# EAGLE design qo-100-env-sensors (EAGLE 9.6.1)
CNAME: None; CREVISION: 1; DESIGNER: Joao Silva
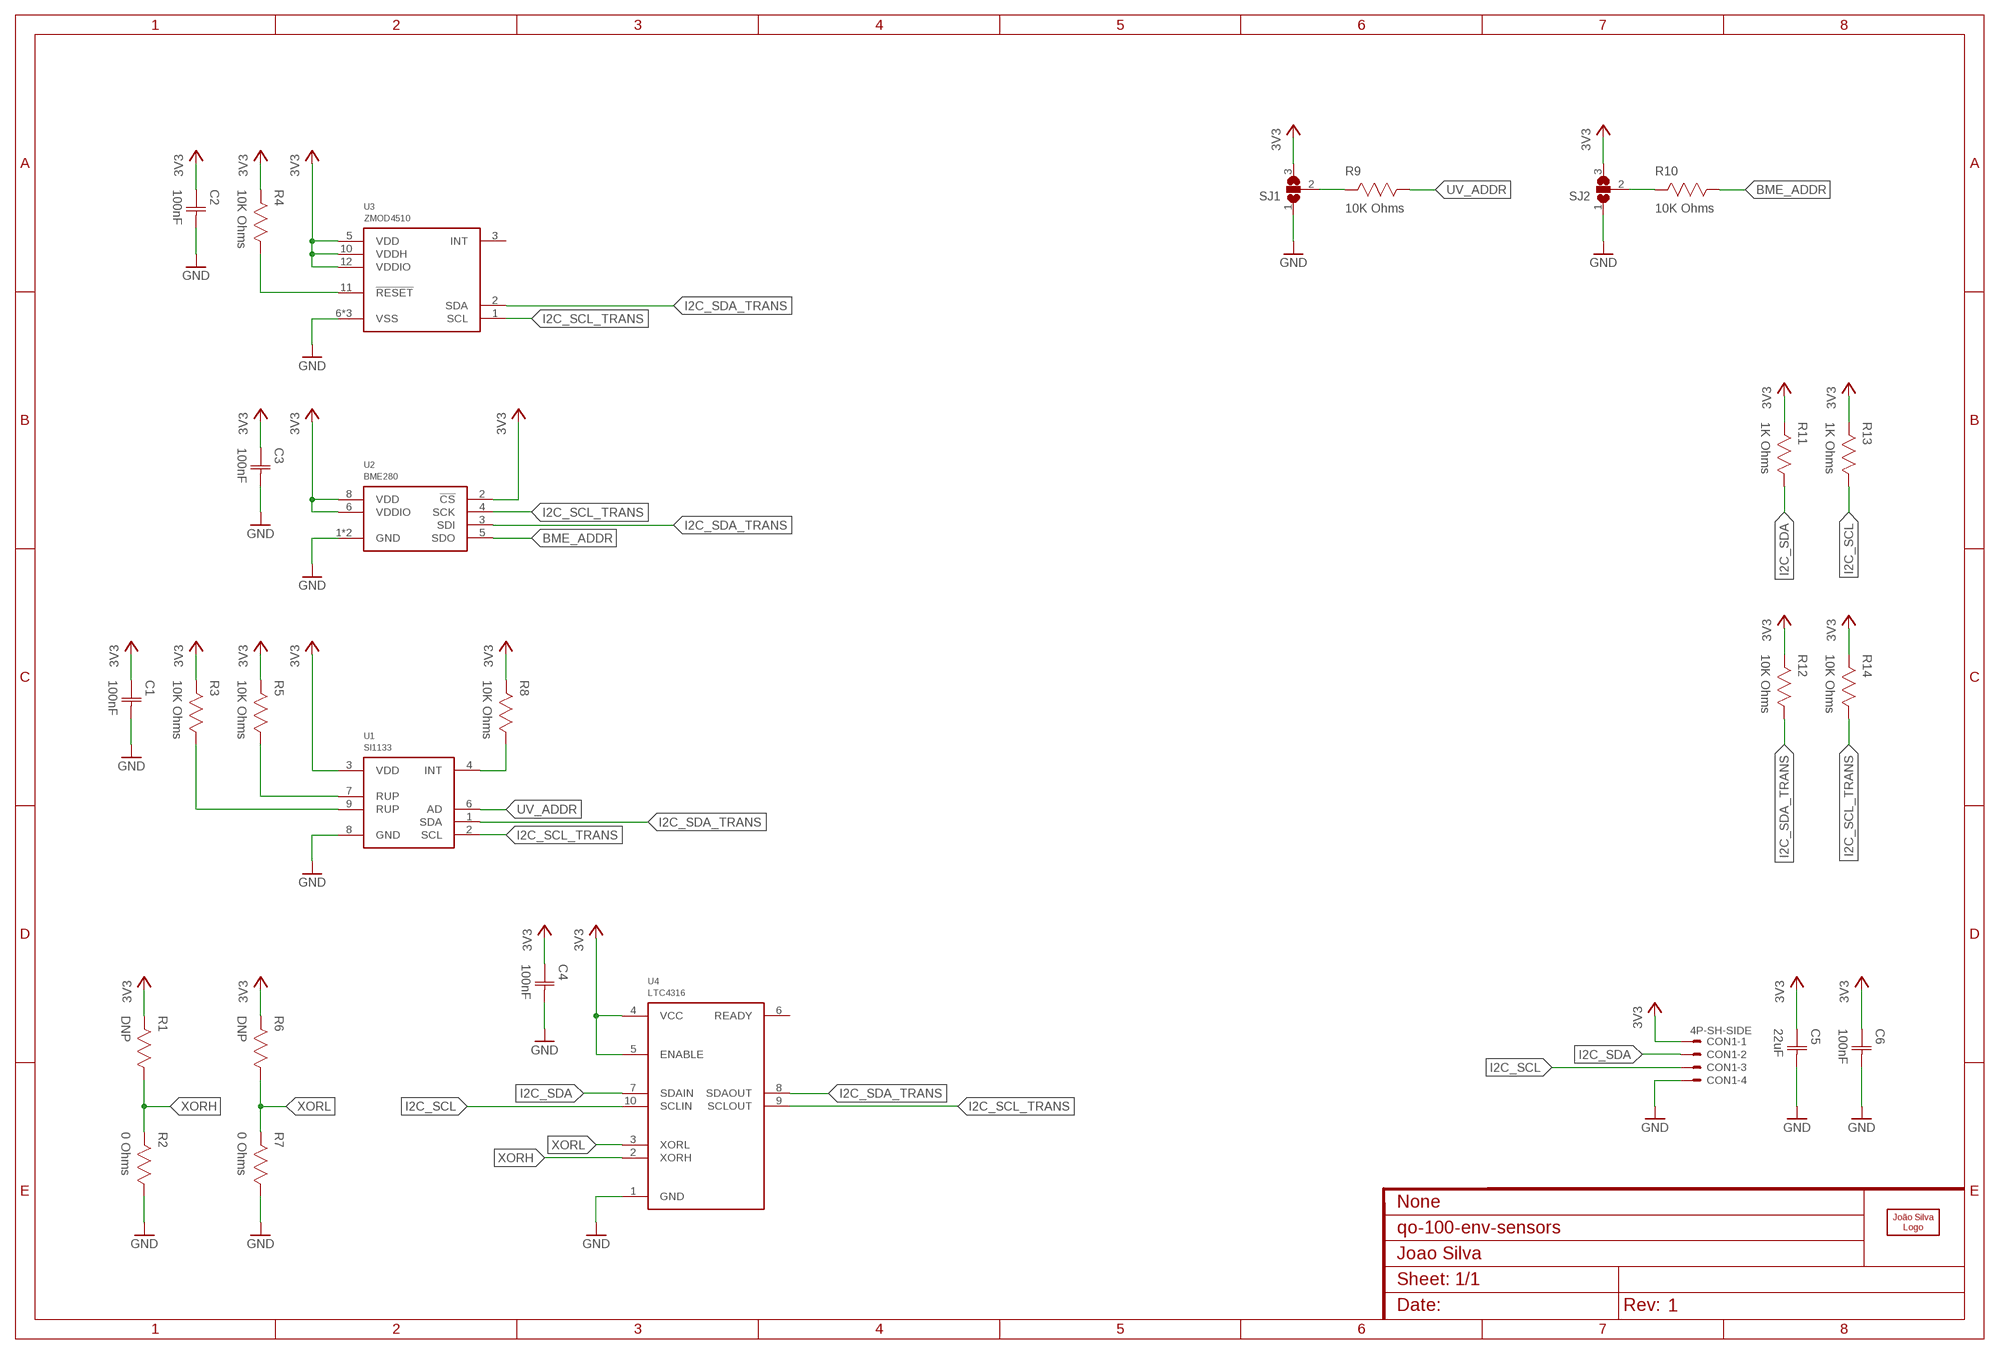
[diagram p0: schematic, sheet 1]

## Parts
C1  100nF  CAPACITOR-0603  [CAP0603]
C2  100nF  CAPACITOR-0603  [CAP0603]
C3  100nF  CAPACITOR-0603  [CAP0603]
C4  100nF  CAPACITOR-0603  [CAP0603]
C5  22uF  CAPACITOR-1206  [CAP1206]
C6  100nF  CAPACITOR-0603  [CAP0603]
CON1  4P-SH-SIDE  [SH-04-SIDE]
LOGO1  JS-5MM  [JS_5MM]
R1  DNP  RESISTOR-0603  [RES0603]
R2  0 Ohms  RESISTOR-0603  [RES0603]
R3  10K Ohms  RESISTOR-0603  [RES0603]
R4  10K Ohms  RESISTOR-0603  [RES0603]
R5  10K Ohms  RESISTOR-0603  [RES0603]
R6  DNP  RESISTOR-0603  [RES0603]
R7  0 Ohms  RESISTOR-0603  [RES0603]
R8  10K Ohms  RESISTOR-0603  [RES0603]
R9  10K Ohms  RESISTOR-0603  [RES0603]
R10  10K Ohms  RESISTOR-0603  [RES0603]
R11  1K Ohms  RESISTOR-0603  [RES0603]
R12  10K Ohms  RESISTOR-0603  [RES0603]
R13  1K Ohms  RESISTOR-0603  [RES0603]
R14  10K Ohms  RESISTOR-0603  [RES0603]
SJ1  SJ2S  [SJ2_S]
SJ2  SJ2S  [SJ2_S]
U1  SI1133  [DFN10]
U2  BME280  [BME280]
U3  ZMOD4510  [LGA12]
U4  LTC4316  [MSOP10]

## Nets
3V3: C1.1(C1) C2.1(C1) C3.1(C1) C4.1(C1) C5.1(C1) C6.1(C1) CON1.1 R1.2 R3.2 R4.2 R5.2 R6.2 R8.2 R11.2 R12.2 R13.2 R14.2 SJ1.3 SJ2.3 U1.3(VDD) U2.2(!CS) U2.6(VDDIO) U2.8(VDD) U3.5(VDD) U3.10(VDDH) U3.12(VDDIO) U4.4(VCC) U4.5(ENABLE)
BME_ADDR: R10.1 U2.5(SDO)
GND: C1.2(C2) C2.2(C2) C3.2(C2) C4.2(C2) C5.2(C2) C6.2(C2) CON1.4 R2.1 R7.1 SJ1.1 SJ2.1 U1.8(GND) U2.1(GND) U2.7(GND) U3.6(VSS) U3.7(VSS) U3.9(VSS) U4.1(GND)
I2C_SCL: CON1.3 R13.1 U4.10(SCLIN)
I2C_SCL_TRANS: R14.1 U1.2(SCL) U2.4(SCK) U3.1(SCL) U4.9(SCLOUT)
I2C_SDA: CON1.2 R11.1 U4.7(SDAIN)
I2C_SDA_TRANS: R12.1 U1.1(SDA) U2.3(SDI) U3.2(SDA) U4.8(SDAOUT)
N$1: R4.1 U3.11(!RESET)
N$2: R3.1 U1.9(RUP)
N$3: R8.1 U1.4(INT)
N$4: R10.2 SJ2.2
N$5: R9.2 SJ1.2
N$6: R5.1 U1.7(RUP)
UV_ADDR: R9.1 U1.6(AD)
XORH: R1.1 R2.2 U4.2(XORH)
XORL: R6.1 R7.2 U4.3(XORL)
Unconnected: U3.3(INT) U4.6(READY)

## Library data of the parts
C1-C6 = Capacitor:CAPACITOR
CON1 = JST:4P: Disconnectable Crimp style connector, 1.0mm pitch 4 contacts
LOGO1 = Silkscreen:JS
R1-R14 = Resistor:RESISTOR
SJ1 SJ2 = Solder Jumper:SJ2
U1 = Silicon Labs:SI1133
U2 = Bosch:BME280
U3 = Renesas:ZMOD4*10
U4 = Analog Devices:LTC4316

## Board
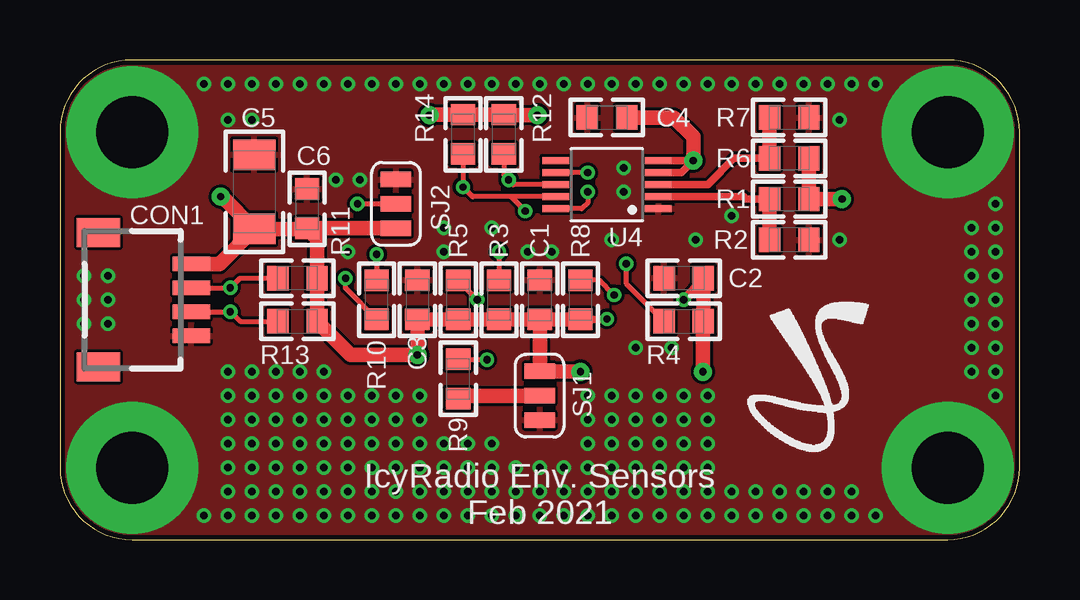
[diagram p1: board, top side]
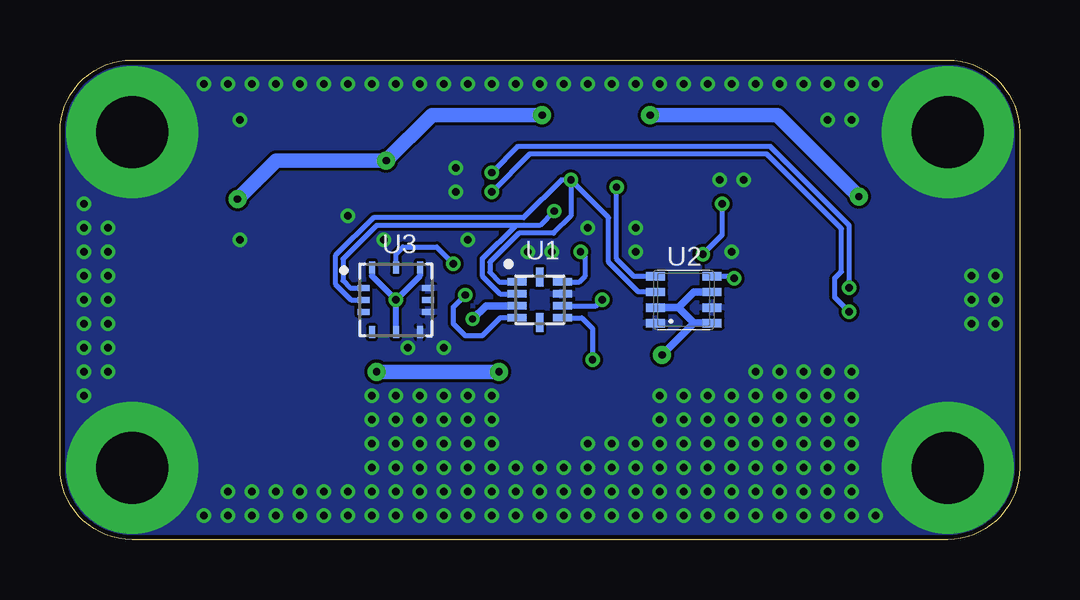
[diagram p2: board, bottom side, seen from below]

Size 40 x 20 mm. Coordinates in mm from the lower left corner, seen from the top.
Outline: 0,17 0,3 arc90 3,0 37,0 arc90 40,3 40,17 arc90 37,20 3,20 arc90 0,17
Copper layers (1*16): Top 0.035mm / dielectric 1.6mm / Bottom 0.035mm
Design rules "jlcpcb_2layer": minimum track width 5mil, minimum drill 0.3mm, track to track 5mil, track to pad 5mil, pad to pad 5mil, via to via 5mil, smd to smd 5mil, copper to edge 0.2mm, drill to drill 5mil, minimum pad ring 3mil, minimum via ring 3mil, stop-mask expansion 0.075mm, vias tented up to drill 10mm, thermal gap 5mil

### Footprints (pad centres in the part's own frame; a part is rotated, then mirrored left to right if it is on the bottom)
CAP0603 = smd 0.889 x 1.016: 1 -0.819,0; 2 0.819,0
CAP1206 = smd 1.27 x 1.778: 1 -1.549,0; 2 1.549,0
SH-04-SIDE = smd 0.6 x 1.55: 1 -1.5,2.975; 2 -0.5,2.975; 3 0.5,2.975; 4 1.5,2.975 | smd 1.2 x 1.8: FIT@1 -2.8,-0.9; FIT@2 2.8,-0.9
RES0603 = smd 0.889 x 1.016: 1 -0.819,0; 2 0.819,0
SJ2_S = smd 0.635 x 1.27: 1 -1.016,0; 2 0,0; 3 1.016,0
DFN10 = smd 0.8 x 0.3: 1 -0.95,0.75; 2 -0.95,0.25; 3 -0.95,-0.25; 4 -0.95,-0.75; 6 0.95,-0.75; 7 0.95,-0.25; 8 0.95,0.25; 9 0.95,0.75 | smd 0.3 x 0.8: 5 0,-0.95; 10 0,0.95
BME280 = smd 0.35 x 0.8: 1 0.975,-1.175; 2 0.325,-1.175; 3 -0.325,-1.175; 4 -0.975,-1.175; 5 -0.975,1.175; 6 -0.325,1.175; 7 0.325,1.175; 8 0.975,1.175
LGA12 = smd 0.5 x 0.25: 1 -1.35,0.5; 2 -1.35,0; 3 -1.35,-0.5; 7 1.35,-0.5; 8 1.35,0; 9 1.35,0.5 | smd 0.25 x 0.5: 4 -1,-1.35; 5 0,-1.35; 6 1,-1.35; 10 1,1.35; 11 0,1.35; 12 -1,1.35
MSOP10 = smd 0.3 x 1.1: 1 -1,-2.14; 2 -0.5,-2.14; 3 0,-2.14; 4 0.5,-2.14; 5 1,-2.14; 6 1,2.14; 7 0.5,2.14; 8 0,2.14; 9 -0.5,2.14; 10 -1,2.14

### Placement (x,y rotation side)
C1  20,10 90 top
C2  26,10.9 180 top
C3  14.9,10 90 top
C4  22.8,17.6 180 top
C5  8.1,14.5 90 top
C6  10.3,13.8 90 top
CON1  2.5,10 270 top
LOGO1  33.9,10.1 0 top
R1  30.4,14.2 0 top
R2  30.4,12.5 180 top
R3  18.3,10 270 top
R4  26,9.1 0 top
R5  16.6,10 270 top
R6  30.4,15.9 0 top
R7  30.4,17.6 180 top
R8  21.7,10 270 top
R9  16.6,6.7 270 top
R10  13.2,10 90 top
R11  9.9,10.9 0 top
R12  18.5,16.9 90 top
R13  9.9,9.1 0 top
R14  16.8,16.9 90 top
SJ1  20,6 90 top
SJ2  14,14 270 top
U1  20,10 0 bottom
U2  14,10 270 bottom
U3  26,10 0 bottom
U4  22.8,14.8 90 top

### Tracks (layer width: path | path; a pad name or v marks a point on that pad's centre or on a via)
3V3  (via drill 0.3, 0.3 pad 0.75)
  Top 0.305: v22.8,9.2 22.78,9.18 R8.2 | U4.5 v26.4,15.8 25.9,15.3 U4.4
  Top 0.406: v26,10 26.82,10.82 C2.1
  Top 0.61: CON1.1 6.65,11.5 C5.1 | C6.1 10.27,12.95 C5.1 | 10.32,13 C6.1 | SJ2.3 C6.1 | C6.1 10.72,12.56 R11.2 R13.2 12.12,7.7 v14.9,7.7 C3.1 R5.2 R3.2 C1.1 | C1.1 21.1,9.18 R8.2 | C1.1 SJ1.3 21.68,7.02 v21.7,7 | v26.8,7 26.8,9.08 R4.2 C2.1 | v32.6,14.2 R1.2 R6.2 | v26.4,15.8 26.4,16.8 25.6,17.6 C4.1 | v19.9,17.7 18.52,17.7 R12.2 R14.2 15.42,17.72 v15.4,17.7 | C5.1 6.75,14.3 v6.7,14.3
  Bottom 0.254: U3.5 v26,10 | U3.10 25,11 v26,10 | U3.12 27,11 v26,10
  Bottom 0.305: U2.8 13.57,9.03 | 13.57,9.03 v14.9,7.7 | U2.2 14.22,9.68 | 14.22,9.68 13.57,9.03 | U2.6 13.57,10.32 14.22,9.68 | U1.3 22.25,9.75 v22.8,9.2
  Bottom 0.61: v21.7,7 v26.8,7 | v32.6,14.2 31,15.8 v26.4,15.8 24.5,17.7 v19.9,17.7 | v6.7,14.3 10.1,17.7 v15.4,17.7
BME_ADDR  (via drill 0.3)
  Top 0.2: R10.1 11.9,10.48 v11.9,10.9
  Bottom 0.2: v11.9,10.9 11.97,10.97 U2.5
GND  (via drill 0.3, 3 pad 5.5)
  other vias: 32,1 32,2 31,2 30,2 30,1 31,1 33,1 33,2 2,9 1,9 1,10 2,10 2,11 1,11 37,3 3,3 3,17 37,17 20,1 20,2 19,2 18,2 18,1 19,1 21,1 21,2 24,1 24,2 23,2 22,2 22,1 23,1 25,1 25,2 28,1 28,2 27,2 26,2 26,1 27,1 29,1 29,2 17,2 17,1 7,1 7,2 34,1 6,1 8,1 8,2 11,1 11,2 10,2 9,2 9,1 10,1 12,1 12,2 15,1 15,2 14,2 13,2 13,1 14,1 16,1 16,2 32,19 30,19 31,19 33,19 20,19 18,19 19,19 21,19 24,19 22,19 23,19 25,19 28,19 26,19 27,19 29,19 17,19 7,19 34,19 6,19 8,19 11,19 9,19 10,19 12,19 15,19 13,19 14,19 16,19 39,14 38,13 38,12 39,12 39,13 38,11 39,11 39,6 39,9 38,9 38,8 38,7 39,7 39,8 39,10 38,10 12,12 7,7 8,7 11,7 10,7 9,7 7,5 7,6 8,5 8,6 11,5 11,6 10,6 9,6 9,5 10,5 12,5 12,6 15,5 15,6 14,6 13,6 13,5 14,5 17,4 17,3 7,3 7,4 8,3 8,4 11,3 11,4 10,4 9,4 9,3 10,3 12,3 12,4 15,3 15,4 14,4 13,4 13,3 14,3 16,3 16,4 21,3 20,3 19,3 18,4 18,3 24,5 24,6 23,6 22,6 22,5 23,5 25,5 25,6 27,6 26,6 26,5 27,5 24,3 24,4 23,4 22,4 22,3 23,3 25,3 25,4 27,4 26,4 26,3 27,3 16,13 16,12 19.5,12 20.5,12 23.5,15.5 23.5,14.5 7,17.5 8,17.5 11.5,15 12.5,15 18,13 32.5,17.5 32.5,12.5 28,13.5 26.5,12.5 23,12.5 24,8 25.5,8
  pour Top (rank 6): -1,21 41,21 41,-1 -1,-1
  pour Bottom (rank 6): -2,22 42,22 42,-2 -2,-2
I2C_SCL  (via drill 0.3)
  Top 0.2: CON1.3 v7.1,9.5 7.5,9.1 R13.1 | v22,14.5 22,14.04 21.76,13.8 U4.10
  Bottom 0.2: v7.1,9.5 7.7,10.1 7.7,10.9 7.43,11.17 7.43,12.96 10.54,16.07 20.43,16.07 v22,14.5
I2C_SCL_TRANS  (via drill 0.3)
  Top 0.2: U4.9 18.8,14.3 | 18.8,14.3 17.2,14.3 v16.8,14.7 R14.1 | 18.8,14.3 v19.4,13.7
  Bottom 0.2: U2.4 16.07,10.97 16.8,11.7 v16.8,14.7 | v19.4,13.7 20,13.1 21,13.1 | 21,13.1 22.4,11.7 22.4,11 21.65,10.25 U1.2 | 21,13.1 26.8,13.1 28.2,11.7 28.2,10.8 27.9,10.5 U3.1
I2C_SDA  (via drill 0.3)
  Top 0.2: CON1.2 v7.1,10.5 7.5,10.9 R11.1 | v22,15.3 U4.7
  Bottom 0.2: v7.1,10.5 7.1,13.1 10.4,16.4 20.9,16.4 v22,15.3
I2C_SDA_TRANS  (via drill 0.3)
  Top 0.2: U4.8 18.9,14.8 v18.7,15 18.5,15.2 R12.1
  Bottom 0.2: U2.3 15.89,10.32 17.13,11.56 17.13,13.43 v18.7,15 | v18.7,15 18.7,13.5 19.43,12.77 20.86,12.77 22.07,11.56 22.07,11.13 21.69,10.75 U1.1 | v18.7,15 19.1,15 20.67,13.43 26.93,13.43 28.53,11.84 28.53,10.66 27.86,10 U3.2
N$1  (via drill 0.3)
  Top 0.2: v23.6,11.5 23.6,10.68 R4.1
  Bottom 0.2: U3.11 26,11.9 25.7,12.2 24.3,12.2 v23.6,11.5
N$2  (via drill 0.3)
  Top 0.2: v18.3,12 R3.1
  Bottom 0.2: U1.9 18.35,10.75 18.1,11 18.1,11.8 v18.3,12
N$3  (via drill 0.3)
  Top 0.2: v23.1,10.2 22.48,10.82 R8.1
  Bottom 0.2: U1.4 21.65,9.25 22.4,8.5 23.1,8.5 23.6,9 23.6,9.7 v23.1,10.2
N$4  (via drill 0.3)
  Top 0.2: SJ2.2 v12.4,14 | v13.2,11.9 R10.2
  Bottom 0.2: v12.4,14 12.4,12.7 v13.2,11.9
N$5
  Top 0.61: SJ1.2 16.72,6 R9.2
N$6  (via drill 0.3)
  Top 0.2: v17.4,10 16.6,10.8 R5.1
  Bottom 0.2: U1.7 17.65,9.75 v17.4,10
UV_ADDR  (via drill 0.3)
  Top 0.2: v17.8,7.5 16.62,7.5 R9.1
  Bottom 0.2: U1.6 18.25,9.25 17.8,8.8 v17.8,7.5
XORH
  Top 0.305: U4.2 28.5,14.3 28.6,14.2 R1.1
  Top 0.61: R1.1 R2.2
XORL
  Top 0.305: U4.3 27,14.8 28.1,15.9 R6.1
  Top 0.61: R7.2 R6.1

### Text on the board
tPlace: IcyRadio Env. Sensors / Feb 2021